# EAGLE design MoleNet_v21 (EAGLE 7.5.0)
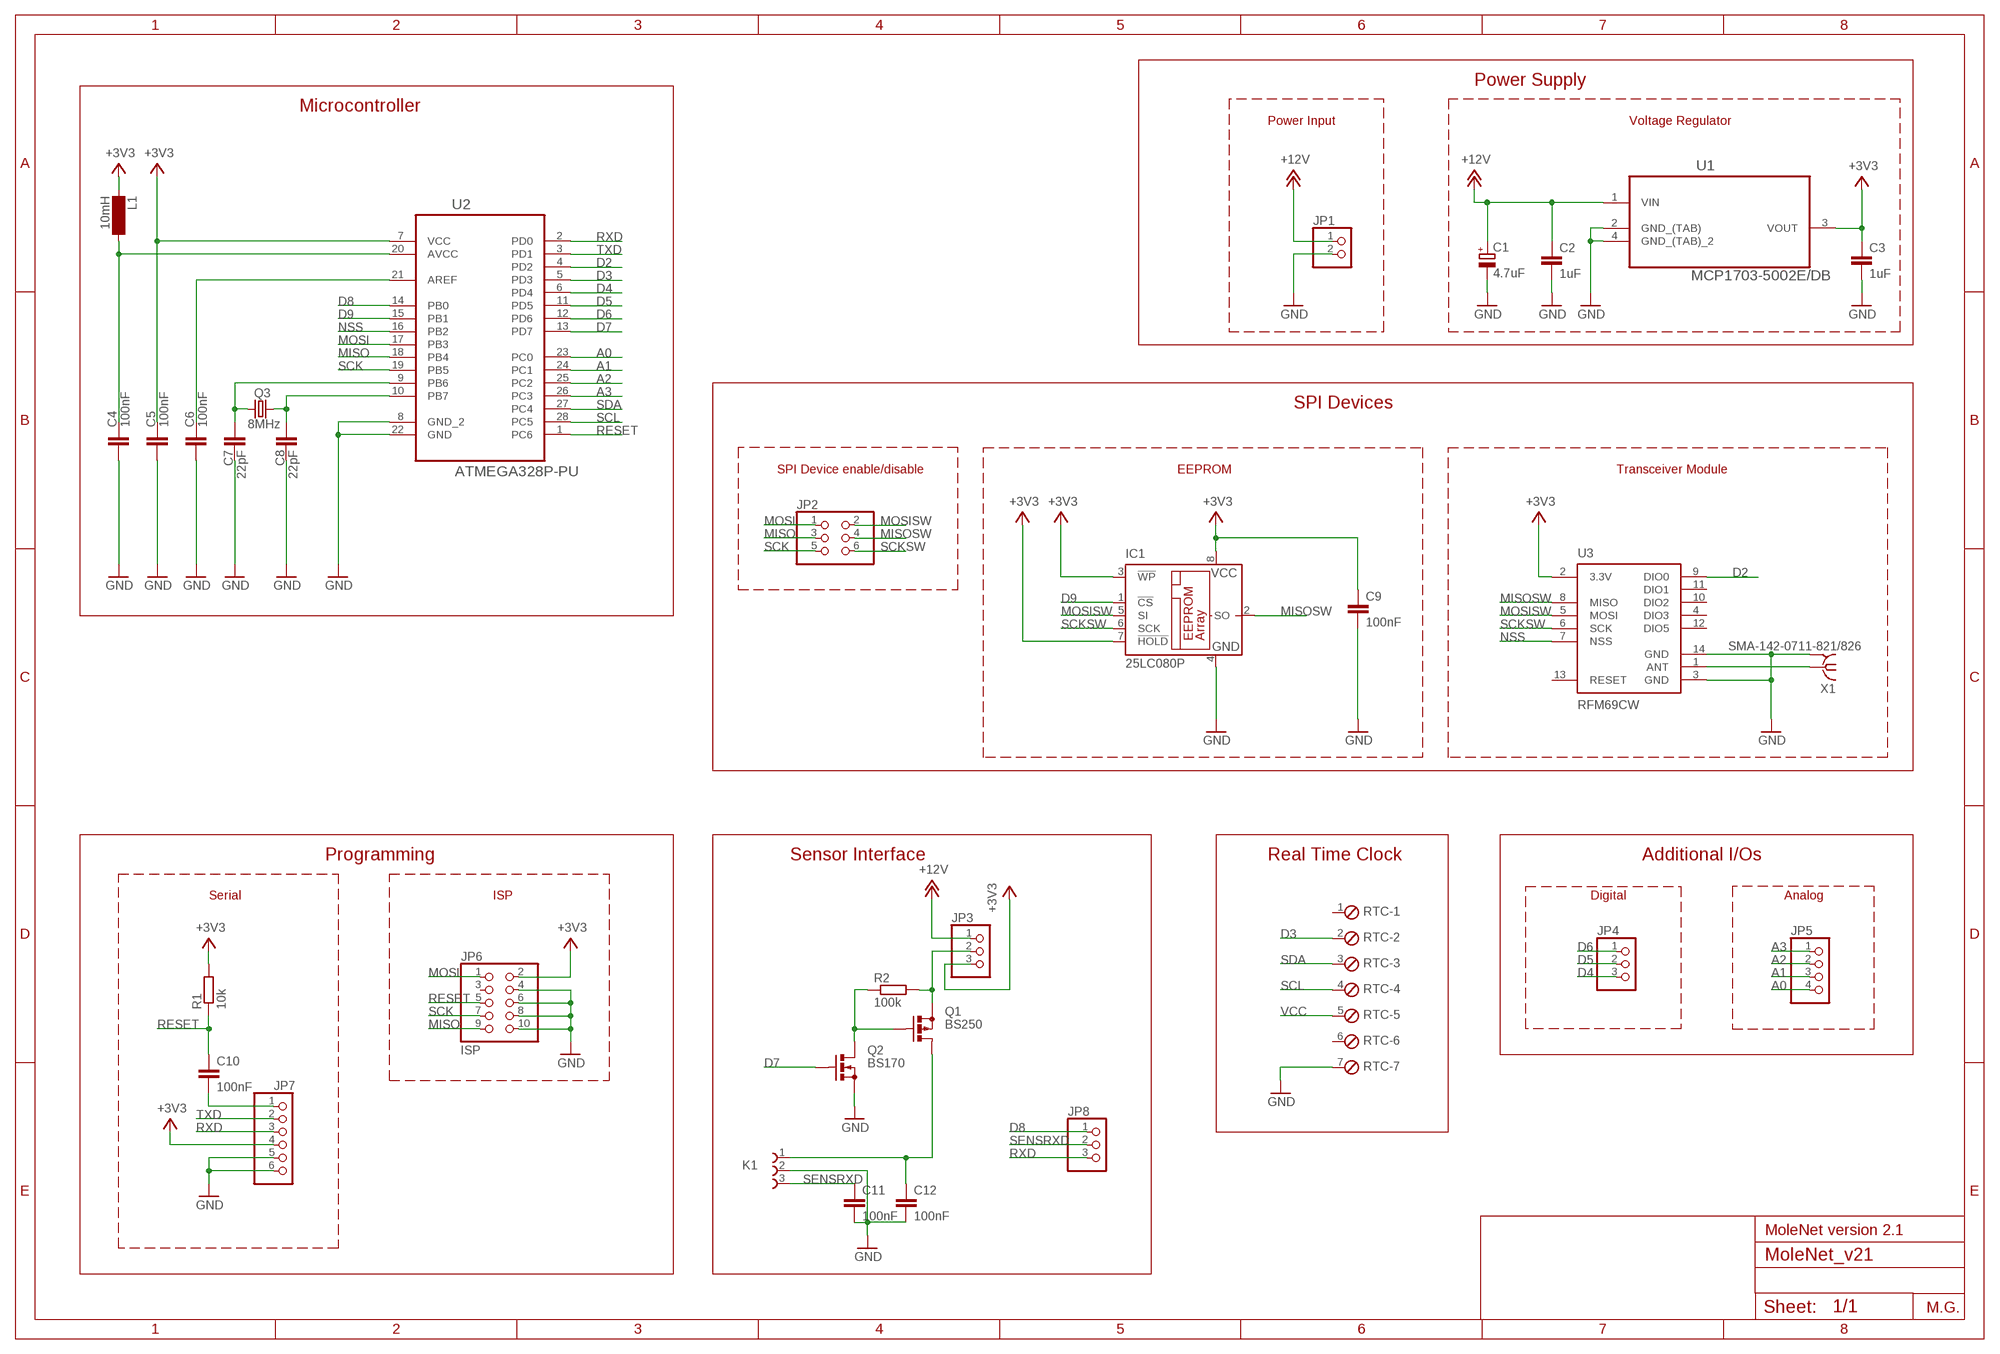
[diagram p0: schematic, sheet 1]

## Parts
C1  4.7uF  CPOL-EUE2.5-6  [E2,5-6]
C2  1uF  C-EU025-025X050  [C025-025X050]
C3  1uF  C-EU025-025X050  [C025-025X050]
C4  100nF  C-EU025-025X050  [C025-025X050]
C5  100nF  C-EU025-025X050  [C025-025X050]
C6  100nF  C-EU025-025X050  [C025-025X050]
C7  22pF  C-EU025-025X050  [C025-025X050]
C8  22pF  C-EU025-025X050  [C025-025X050]
C9  100nF  C-EU025-025X050  [C025-025X050]
C10  100nF  C-EU025-025X050  [C025-025X050]
C11  100nF  C-EU025-025X050  [C025-025X050]
C12  100nF  C-EU025-025X050  [C025-025X050]
IC1  25LC080P  [DIL8]
JP1  PINHD-1X2  [1X02]
JP2  PINHD-2X3  [2X03]
JP3  PINHD-1X3  [1X03]
JP4  PINHD-1X3  [1X03]
JP5  PINHD-1X4  [1X04]
JP6  ISP  PINHD-2X5  [2X05]
JP7  PINHD-1X6  [1X06]
JP8  PINHD-1X3  [1X03]
K1  691241710003  [691241710003]
L1  10mH  BS11  [BS11]
Q1  BS250  [SOT54E]
Q2  BS170  [SOT54E]
Q3  8MHz  CRYSTALHC18U-V  [HC18U-V]
R1  10k  R-EU_0207/10  [0207/10]
R2  100k  R-EU_0207/10  [0207/10]
RTC  MPT7  [7POL254]
U1  MCP1703-5002E/DB  [SOT230P700X180-4N]
U2  ATMEGA328P-PU  [DIP254P762X457-28]
U3  RFM69CW  [RFM69CW-XXXS2]
X1  SMA-142-0711-821/826  [J502-ND-142-0711-821/826]

## Nets
+12V: C1.+ C2.1 JP1.1 JP3.1 U1.1(VIN)
A0: JP5.4 U2.23(PC0)
A1: JP5.3 U2.24(PC1)
A2: JP5.2 U2.25(PC2)
A3: JP5.1 U2.26(PC3)
D2: U2.4(PD2) U3.9(DIO0)
D3: RTC.2 U2.5(PD3)
D4: JP4.3 U2.6(PD4)
D5: JP4.2 U2.11(PD5)
D6: JP4.1 U2.12(PD6)
D7: Q2.G U2.13(PD7)
D8: JP8.1 U2.14(PB0)
D9: IC1.1(!CS) U2.15(PB1)
GND: C1.- C2.2 C3.2 C4.2 C5.2 C6.2 C7.2 C8.2 C9.2 C11.2 C12.2 IC1.4(GND) JP1.2 JP6.4 JP6.6 JP6.8 JP6.10 JP7.5 JP7.6 K1.2 Q2.S RTC.7 U1.2(GND_(TAB)) U1.4(GND_(TAB)_2) U2.8(GND_2) U2.22(GND) U3.3(GND) U3.14(GND) X1.G@1 X1.G@2 X1.G@3 X1.G@4
MISO: JP2.3 JP6.9 U2.18(PB4)
MISOSW: IC1.2(SO) JP2.4 U3.8(MISO)
MOSI: JP2.1 JP6.1 U2.17(PB3)
MOSISW: IC1.5(SI) JP2.2 U3.5(MOSI)
N$1: Q1.G Q2.D R2.1
N$2: JP3.2 Q1.S R2.2
N$3: C7.1 Q3.1 U2.9(PB6)
N$4: C8.1 Q3.2 U2.10(PB7)
N$5: C4.1 L1.2 U2.20(AVCC)
N$6: C6.1 U2.21(AREF)
N$9: C10.2 JP7.1
N$10: C12.1 K1.1 Q1.D
N$15: U3.1(ANT) X1.1
NSS: U2.16(PB2) U3.7(NSS)
RESET: C10.1 JP6.5 R1.1 U2.1(PC6)
RXD: JP7.3 JP8.3 U2.2(PD0)
SCK: JP2.5 JP6.7 U2.19(PB5)
SCKSW: IC1.6(SCK) JP2.6 U3.6(SCK)
SCL: RTC.4 U2.28(PC5)
SDA: RTC.3 U2.27(PC4)
SENSRXD: C11.1 JP8.2 K1.3
TXD: JP7.2 U2.3(PD1)
VCC: C3.1 C5.1 C9.1 IC1.3(!WP) IC1.7(!HOLD) IC1.8(VCC) JP3.3 JP6.2 JP7.4 L1.1 R1.2 RTC.5 U1.3(VOUT) U2.7(VCC) U3.2(3.3V) ; supply symbol labelled +3V3
Unconnected: JP6.3 RTC.1 RTC.6 U3.4(DIO3) U3.10(DIO2) U3.11(DIO1) U3.12(DIO5) U3.13(RESET)

## Notes on the sheet
- Power Supply
- Microcontroller
- Power Input | Voltage Regulator
- SPI Devices
- SPI Device enable/disable | EEPROM | Transceiver Module
- Programming | Sensor Interface | Real Time Clock | Additional I/Os
- Serial | ISP | Digital | Analog
- MoleNet version 2.1
- M.G.

## Library data of the parts
C1 = resistor:CPOL-EU: POLARIZED CAPACITOR, European symbol
C2-C12 = resistor:C-EU: CAPACITOR, European symbol
IC1 = microchip:25*: Serial EEPROM 4K/ 8K , SPI bus; MF: MICROCHIP; MPN: 25LC080/P; OC_FARNELL: 1556143; OC_NEWARK: 92C7440
JP1 = pinhead:PINHD-1X2: PIN HEADER
JP2 = pinhead:PINHD-2X3: PIN HEADER
JP3 JP4 JP8 = pinhead:PINHD-1X3: PIN HEADER
JP5 = pinhead:PINHD-1X4: PIN HEADER
JP6 = pinhead:PINHD-2X5: PIN HEADER
JP7 = pinhead:PINHD-1X6: PIN HEADER
K1 = Terminal_Blocks_Connectors_rev15e:691241710003: SERIE 2417 - 5.00 MM - HORIZONTAL CABLE ENTRY WITH RISING CAGE CLAMP - WR-TBL =>ConTBL2 691241710003 Characteristics INSULATOR:PA6/66 FLAMABILITY RATING: UL94V0 COLOR: GREEN METAL HOUSING: COPPER ALLOY / Ni+Sn TERMINAL SCREW: STEEL / Zn WIRE GUARD: COPPER ALLOY / Ni+Sn FLANGES NUT: BRASS M2.5 OPERATING TEMPERATURE:-30°C UP TO +120°C COMPLIANCE: LEAD FREE AND ROHS ELECTRICAL UL VDE CURRENT RATING: 14A 14A WORKING VOLTAGE: 300VAC 250VAC WITHSTANDING VOLTAGE: 1,6KV 2KV CONTACT RESISTANCE: 20 mOhm max <http://katalog.we-online.de/media/images/v2/Family_WR-TBL_5_00_2417_HORIZONTAL_CABLE_ENTRY_6912417100XX.jpg> Details see: http://katalog.we-online.de/en/em/TBL_5_00_2417_HORIZONTAL_CABLE_ENTRY_W_RISING_CLAMP_6912417100XX 2015 (C) Wurth Elektronik
L1 = inductor-neosid:BS: INDUCTOR nominal inductance, magnetically screened; OC_FARNELL: unknown; OC_NEWARK: unknown
Q1 = transistor-small-signal:BS250: P-CHANNEL MOS FET
Q2 = transistor-small-signal:BS170: N-CHANNEL MOS FET
Q3 = crystal:CRYSTAL: CRYSTAL; OC_FARNELL: unknown; OC_NEWARK: unknown
R1 R2 = resistor:R-EU_: RESISTOR, European symbol
RTC = con-phoenix-254:MPT7: PHOENIX CONNECTOR; OC_FARNELL: unknown; OC_NEWARK: unknown
U1 = Microchip_By_element14_Batch_1:MCP1703-5002E/DB: IC, LDO REG, 250MA, 5V; MPN: MCP1703-5002E/DB; OC_FARNELL: 1627178; OC_NEWARK: 40M0624; PACKAGE: SOT-223-3; SUPPLIER: Microchip
U2 = Atmel_By_element14_Batch_1-00:ATMEGA328P-PU: 8-bit Microcontroller with In-System Programmable Flash; MPN: ATMEGA328P-PU; OC_FARNELL: 1715487; OC_NEWARK: 15R0268; PACKAGE: PDIP-28; SUPPLIER: Atmel
U3 = SparkFun-RF:RFM69
X1 = con-coax:SMA-: SMA 50 Ohm End Launch Jack Receptacle - Round Contact Johnson Components Source: www.johnsoncomponents.com .. J502-ND.pdf; MF: JOHNSON COMPONENTS; MPN: 142-0711-821; OC_FARNELL: 1019328; OC_NEWARK: 16F3627

## Board
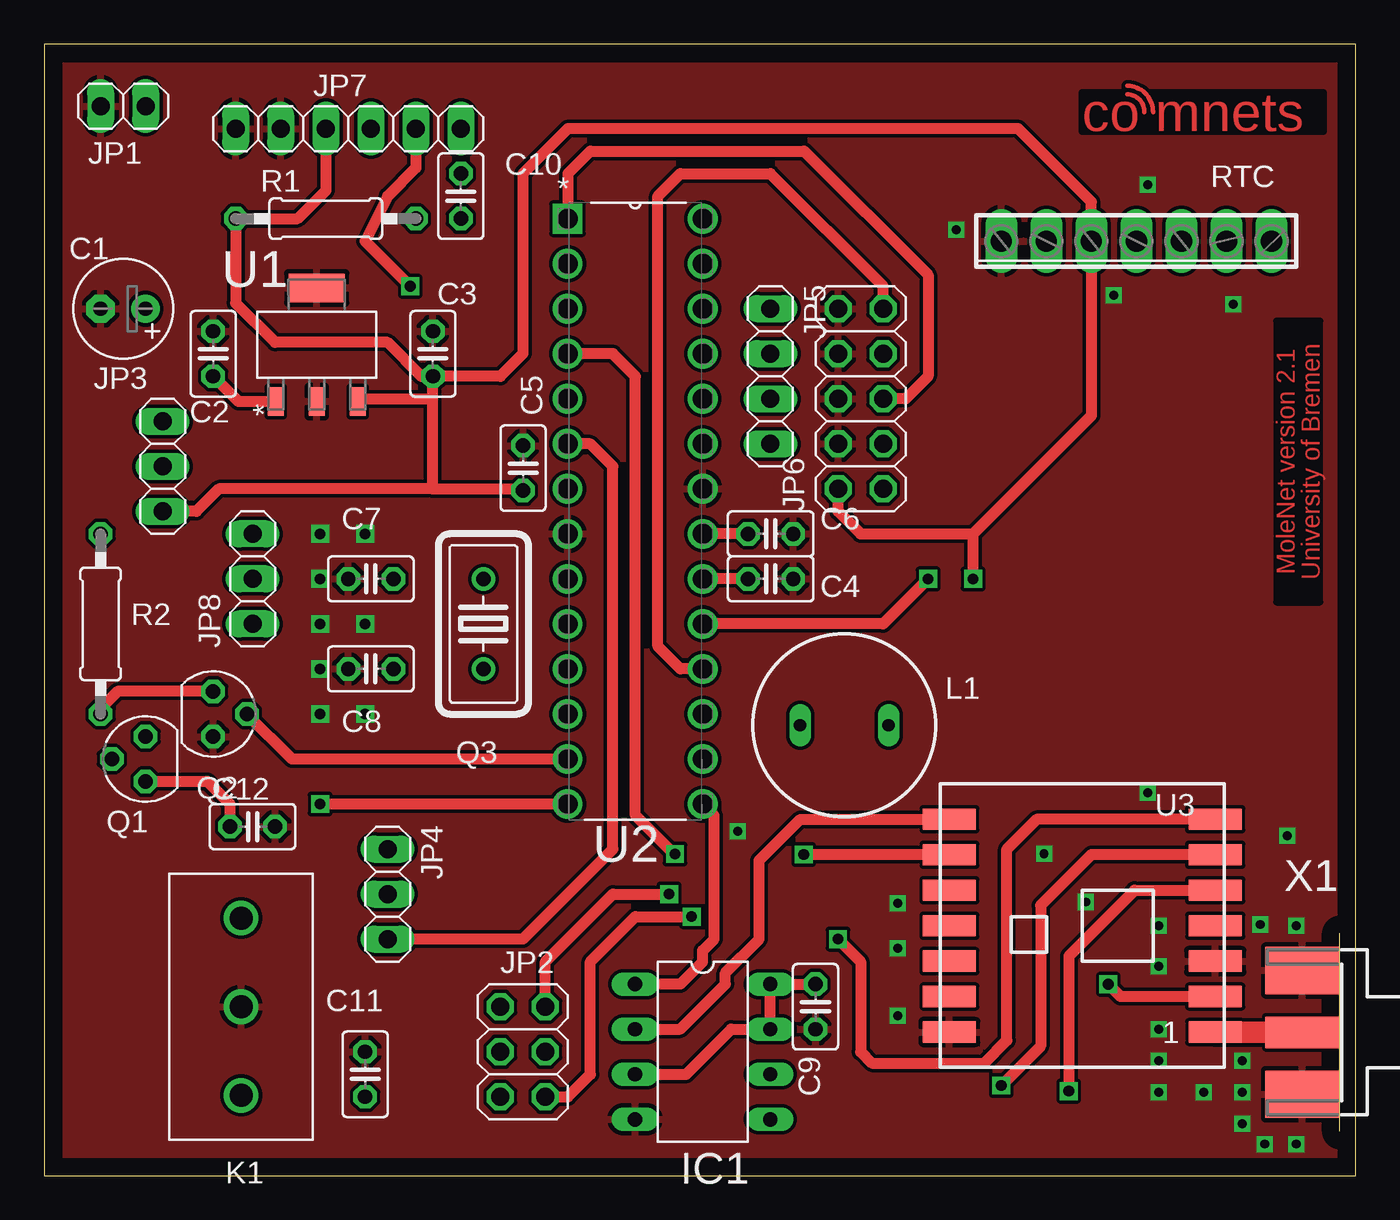
[diagram p1: board, top side]
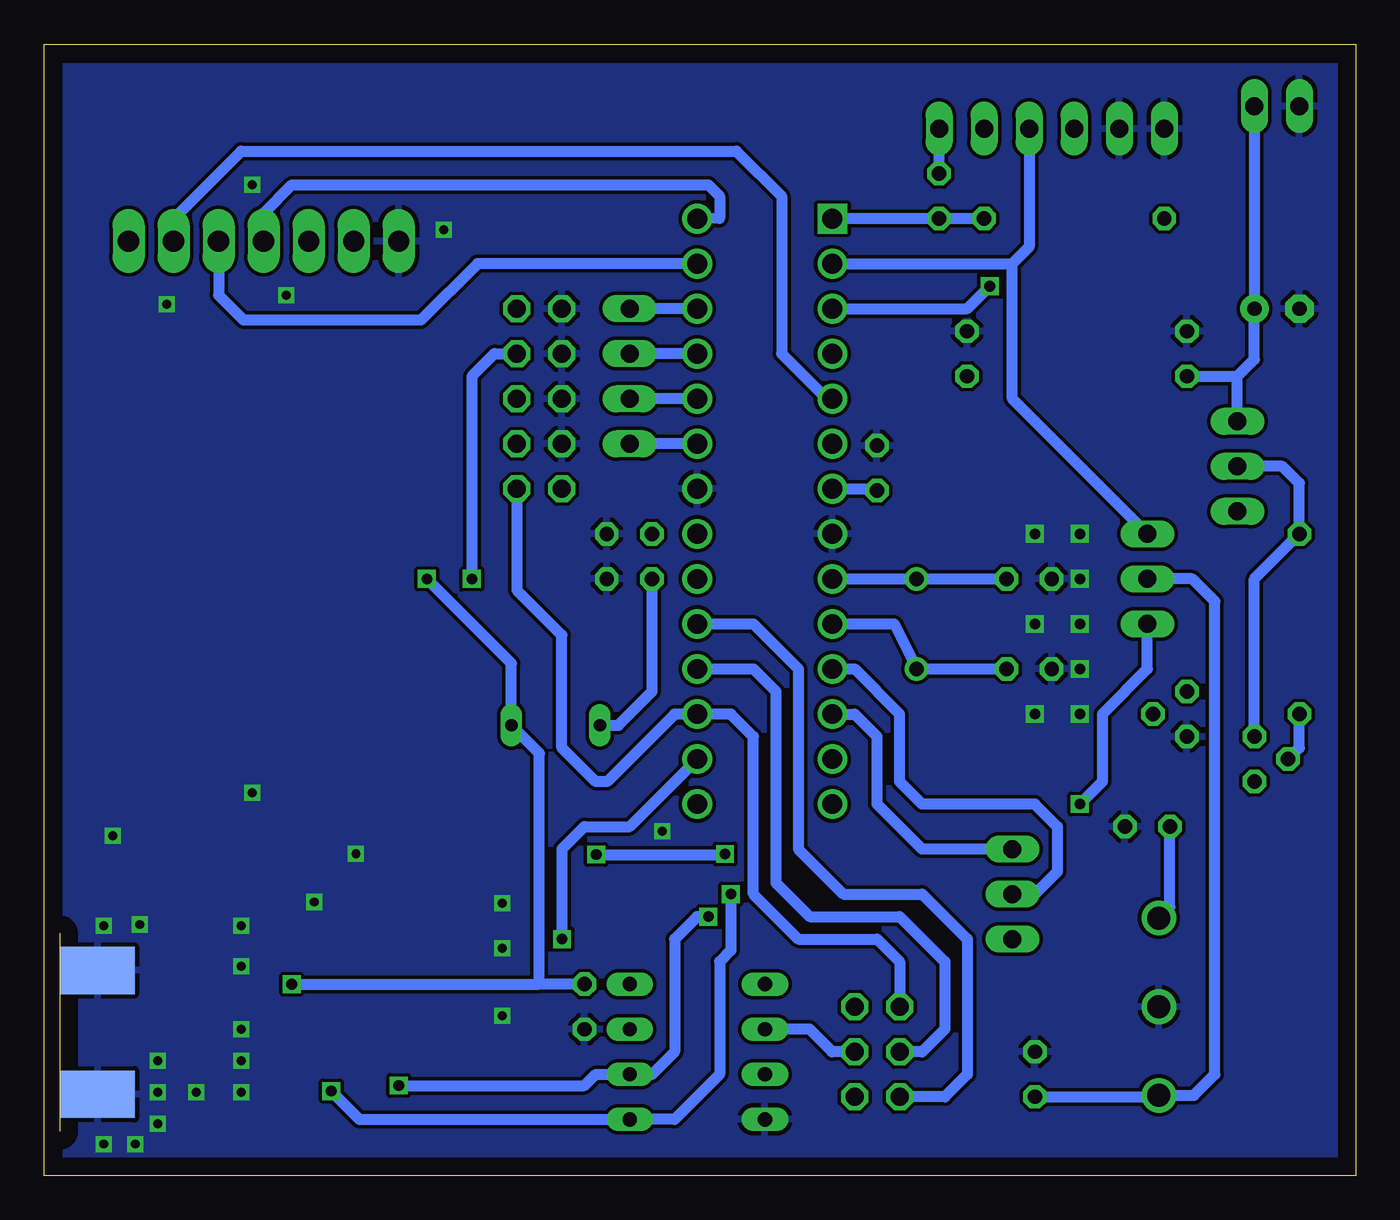
[diagram p2: board, bottom side, seen from below]

Size 73.97 x 63.81 mm. Coordinates in mm from the lower left corner, seen from the top.
Outline: 0,0 73.97,0 73.97,63.81 0,63.81 0,0
Copper layers (1*16): Top 0.035mm / dielectric 1.5mm / Bottom 0.035mm
Design rules "default": minimum track width 10mil, minimum drill 24mil, track to track 8mil, track to pad 8mil, pad to pad 8mil, via to via 8mil, smd to smd 8mil, copper to edge 40mil, drill to drill 8mil, minimum pad ring 10mil, minimum via ring 8mil, stop-mask expansion 4mil, vias tented up to drill 0mil, thermal gap 10mil

### Footprints (pad centres in the part's own frame; a part is rotated, then mirrored left to right if it is on the bottom)
E2,5-6 = drill 0.813 pad 1.6: + -1.27,0 | drill 0.813 pad 1.6 octagon: - 1.27,0
C025-025X050 = drill 0.813 octagon: 1 -1.27,0; 2 1.27,0
DIL8 = drill 0.813 long: 1 -3.81,-3.81; 2 -1.27,-3.81; 3 1.27,-3.81; 4 3.81,-3.81; 5 3.81,3.81; 6 1.27,3.81; 7 -1.27,3.81; 8 -3.81,3.81
1X02 = drill 1.016 long: 1 -1.27,0; 2 1.27,0
2X03 = drill 1.016 octagon: 1 -2.54,-1.27; 2 -2.54,1.27; 3 0,-1.27; 4 0,1.27; 5 2.54,-1.27; 6 2.54,1.27
1X03 = drill 1.016 long: 1 -2.54,0; 2 0,0; 3 2.54,0
1X04 = drill 1.016 long: 1 -3.81,0; 2 -1.27,0; 3 1.27,0; 4 3.81,0
2X05 = drill 1.016 octagon: 1 -5.08,-1.27; 2 -5.08,1.27; 3 -2.54,-1.27; 4 -2.54,1.27; 5 0,-1.27; 6 0,1.27; 7 2.54,-1.27; 8 2.54,1.27; 9 5.08,-1.27; 10 5.08,1.27
1X06 = drill 1.016 long: 1 -6.35,0; 2 -3.81,0; 3 -1.27,0; 4 1.27,0; 5 3.81,0; 6 6.35,0
691241710003 = drill 1.3: 1 -5,0; 2 0,0; 3 5,0
BS11 = drill 0.7 long: 1 -2.5,0; 2 2.5,0
SOT54E = drill 0.813 octagon: D -1.27,0; G 0,1.905; S 1.27,0
HC18U-V = drill 0.813: 1 -2.54,0; 2 2.54,0
0207/10 = drill 0.813 octagon: 1 -5.08,0; 2 5.08,0
7POL254 = drill 1.2 long: 1 -7.62,0; 2 -5.08,0; 3 -2.54,0; 4 0,0; 5 2.54,0; 6 5.08,0; 7 7.62,0
SOT230P700X180-4N = smd 1.626 x 0.889: 1 -3.2,2.311; 2 -3.2,0; 3 -3.2,-2.311 | smd 1.626 x 3.175: 4 3.2,0
DIP254P762X457-28 = drill 1.118 square: 1 -7.62,33.02 | drill 1.118: 2 -7.62,30.48; 3 -7.62,27.94; 4 -7.62,25.4; 5 -7.62,22.86; 6 -7.62,20.32; 7 -7.62,17.78; 8 -7.62,15.24; 9 -7.62,12.7; 10 -7.62,10.16; 11 -7.62,7.62; 12 -7.62,5.08; 13 -7.62,2.54; 14 -7.62,0; 15 0,0; 16 0,2.54; 17 0,5.08; 18 0,7.62; 19 0,10.16; 20 0,12.7; 21 0,15.24; 22 0,17.78; 23 0,20.32; 24 0,22.86; 25 0,25.4; 26 0,27.94; 27 0,30.48; 28 0,33.02
RFM69CW-XXXS2 = smd 3 x 1.2: 1 -7.5,6; 2 -7.5,4; 3 -7.5,2; 4 -7.5,0; 5 -7.5,-2; 6 -7.5,-4; 7 -7.5,-6; 8 7.5,-6; 9 7.5,-4; 10 7.5,-2; 11 7.5,0; 12 7.5,2; 13 7.5,4; 14 7.5,6
J502-ND-142-0711-821/826 = smd 4.191 x 1.778: 1 2.115,0 | smd 4.191 x 2.667: G@1 2.115,3.495; G@2 2.115,-3.495 | smd 4.191 x 2.667 bottom: G@3 2.115,3.495; G@4 2.115,-3.495

### Placement (x,y rotation side)
C1  10uF  [E2,5-6]  4.45,48.89 180 top
C2  [C025-025X050]  9.52,46.35 90 top
C3  [C025-025X050]  21.92,46.35 90 top
C4  [C025-025X050]  40.97,33.66 0 top
C5  [C025-025X050]  27,39.9 90 top
C6  [C025-025X050]  40.97,36.2 0 top
C7  [C025-025X050]  18.41,33.66 180 top
C8  [C025-025X050]  18.41,28.58 180 top
C9  [C025-025X050]  43.5,9.53 270 top
C10  [C025-025X050]  23.5,55.24 90 top
C11  [C025-025X050]  18.1,5.71 90 top
C12  [C025-025X050]  11.75,19.69 0 top
IC1  37.13,6.98 270 top
JP1  4.45,60.32 180 top
JP2  26.99,6.98 270 top
JP3  6.67,40 270 top
JP4  19.37,15.88 270 top
JP5  40.96,45.09 270 top
JP6  46.04,43.81 90 top
JP7  17.14,59.05 180 top
JP8  11.75,33.66 90 top
K1  11.1,9.53 270 top
L1  [BS11]  45.12,25.4 180 top
Q1  5.72,23.5 90 top
Q2  9.52,26.04 270 top
Q3  [HC18U-V]  24.77,31.12 270 top
R1  [0207/10]  15.88,53.98 180 top
R2  [0207/10]  3.18,31.12 90 top
RTC  61.59,52.7 180 top
U1  15.37,46.86 90 top
U2  37.13,20.96 0 top
U3  58.55,14.1 180 top
X1  73.08,8.08 180 top

### Tracks (layer width: path | path; a pad name or v marks a point on that pad's centre or on a via)
+12V
  Top 0.61: C2.1 10.95,43.66 U1.1
  Bottom 0.61: JP1.1 C1.+ 5.72,46.04 6.67,45.09 | C2.1 6.67,45.09 | JP3.1 6.67,45.09
A0
  Bottom 0.61: U2.23 JP5.4
A1
  Bottom 0.61: U2.24 JP5.3
A2
  Bottom 0.61: U2.25 JP5.2
A3
  Bottom 0.61: U2.26 JP5.1
D2  (via drill 0.6)
  Top 0.61: U2.4 32.07,46.35 33.34,45.09 33.34,20.32 35.52,18.14 v35.57,18.14 | U3.9 44.37,18.1 v42.84,18.11
  Bottom 0.61: v42.84,18.11 35.6,18.11 v35.57,18.14
D3
  Bottom 0.61: RTC.2 66.67,53.98 62.87,57.78 34.92,57.78 32.38,55.24 32.38,46.35 29.84,43.81 U2.5
D4
  Top 0.61: U2.6 30.8,41.27 32.07,40 32.07,18.42 26.99,13.33 JP4.3
D5
  Bottom 0.61: U2.11 28.26,28.58 25.72,26.04 25.72,22.23 24.45,20.96 18.1,20.96 16.83,19.69 16.83,17.15 18.1,15.88 JP4.2
D6
  Bottom 0.61: U2.12 28.26,26.04 26.99,24.77 26.99,20.96 24.45,18.42 JP4.1
D7
  Top 0.61: U2.13 13.97,23.5 Q2.G
D8  (via drill 0.6)
  Top 0.61: U2.14 v15.56,20.96
  Bottom 0.61: JP8.1 11.75,28.58 14.29,26.04 14.29,22.23 v15.56,20.96
D9
  Top 0.61: IC1.1 35.88,10.79 37.13,12.05 37.13,12.69 37.78,13.33 37.78,20.31 U2.15
GND  (via drill 0.5, 0.6)
  other vias: 70.1,19.18 70.61,14.1 70.61,1.78 68.58,14.16 67.56,4.7 67.56,2.92 67.56,6.48 62.87,14.1 62.87,11.81 62.87,8.26 62.87,4.7 48.13,15.37 48.13,12.83 48.13,9.02 58.74,15.43 67.06,49.15 60.33,49.66 62.87,6.48 68.83,1.78 65.41,4.7 56.39,18.16 62.23,21.59 62.23,55.88 39.12,19.43 51.44,53.34 18.1,36.2 15.56,33.66 15.56,31.12 15.56,28.58 18.1,31.12 18.1,26.04 15.56,26.04 15.56,36.2
  pour Top: 0.63,62.86 72.9,62.86 72.9,0.89 0.63,0.89
  pour Bottom: 0.63,62.86 72.9,62.86 72.9,0.89 0.63,0.89
MISO
  Top 0.61: U2.18 35.88,28.58 34.61,29.85 34.61,55.24 35.88,56.52 40.96,56.52 47.31,50.16 JP6.9
  Bottom 0.61: U2.18 33.97,28.58 32.7,27.31 32.7,16.51 30.8,14.61 25.72,14.61 23.18,12.06 23.18,8.26 24.45,6.98 JP2.3
MISOSW
  Top 0.61: U3.8 42.64,20.1 40.32,17.78 40.32,13.33 38.42,11.43 38.42,10.79 35.88,8.26 IC1.2
  Bottom 0.61: JP2.4 29.53,6.98 30.8,8.26 IC1.2
MOSI
  Bottom 0.61: JP2.1 25.72,12.06 26.99,13.33 31.43,13.33 33.97,15.88 33.97,24.77 35.24,26.04 U2.17 38.42,26.04 42.23,22.23 42.86,22.23 44.77,24.13 44.77,30.48 47.31,33.02 JP6.1
MOSISW  (via drill 0.6)
  Top 0.61: U3.5 61.5,16.1 57.78,12.38 v57.78,4.76 | JP2.2 28.26,12.06 32.07,15.88 v35.24,15.88
  Bottom 0.61: v57.78,4.76 56.2,3.17 IC1.5 38.42,3.17 35.88,5.71 35.88,12.06 35.24,12.7 v35.24,15.88
N$1
  Top 0.61: Q2.D 4.13,27.31 3.18,26.35 R2.1
  Bottom 0.61: Q1.G 3.18,24.13 R2.1
N$2
  Bottom 0.61: JP3.2 4.13,40 3.18,39.05 R2.2 5.72,33.66 Q1.S
N$3
  Bottom 0.61: U2.9 Q3.1 C7.1
N$4
  Bottom 0.61: C8.1 Q3.2 26.04,31.12 U2.10
N$5
  Top 0.61: C4.1 U2.20
  Bottom 0.61: L1.2 41.59,25.4 39.69,27.31 39.69,33.64 C4.1
N$6
  Top 0.61: C6.1 U2.21
N$7
  Top 0.254: 61.09,60.98 arc-90 62.05,59.97
N$8
  Top 0.254: 61.09,61.47 arc-90 62.53,59.97
N$9
  Bottom 0.61: C10.2 JP7.1
N$10
  Top 0.61: C12.1 10.48,20.96 9.21,22.23 Q1.D
  Bottom 0.61: K1.1 10.48,15.15 C12.1
N$15
  Top 0.61: U3.1 66.07,8.08
  Top 1.219: 66.07,8.08 X1.1
NSS  (via drill 0.6)
  Top 0.61: v44.77,13.33 46.04,12.06 46.04,6.98 46.67,6.35 53.02,6.35 54.29,7.62 54.29,18.42 55.97,20.1 U3.7
  Bottom 0.61: v44.77,13.33 44.77,18.42 43.5,19.69 40.96,19.69 U2.16
RESET
  Top 0.61: JP6.5 48.58,43.81 49.85,45.09 49.85,50.8 42.86,57.78 30.8,57.78 29.53,56.52 29.53,53.99 U2.1
  Bottom 0.61: R1.1 C10.1 U2.1
RXD
  Bottom 0.61: 19.37,51.43 18.41,52.39 JP7.3 | U2.2 19.37,51.43 | 19.37,51.43 19.37,43.81 JP8.3
SCK  (via drill 0.6)
  Top 0.61: v49.85,33.66 47.31,31.12 U2.19
  Bottom 0.61: JP6.7 48.58,46.35 49.85,45.09 v49.85,33.66 | U2.19 33.97,31.12 31.43,28.58 31.43,18.42 28.89,15.88 24.45,15.88 21.91,13.33 21.91,5.71 23.18,4.45 JP2.5
SCKSW  (via drill 0.6)
  Top 0.61: v53.98,5.08 56.2,7.3 56.2,15.24 59.05,18.1 U3.6 | JP2.6 29.53,4.45 30.8,5.71 30.8,12.06 33.34,14.61 v36.51,14.61
  Bottom 0.61: v36.51,14.61 37.15,14.61 38.42,13.33 38.42,6.98 39.69,5.71 IC1.6 42.86,5.71 43.5,5.08 v53.98,5.08
SCL
  Bottom 0.61: RTC.4 61.59,54.29 60.01,55.88 36.51,55.88 35.88,55.24 35.88,53.99 U2.28
SDA
  Bottom 0.61: RTC.3 64.14,49.66 62.74,48.26 52.7,48.26 49.53,51.43 U2.27
SENSRXD
  Bottom 0.61: C11.1 11.18,4.45 K1.3 9.13,4.53 7.94,5.71 7.94,32.38 9.21,33.66 JP8.2
TXD  (via drill 0.6)
  Top 0.61: JP7.2 20.95,56.83 19.37,55.24 18.1,52.7 v20.64,50.16
  Bottom 0.61: U2.3 21.91,48.89 v20.64,50.16
VCC  (via drill 0.6)
  Top 0.61: U3.2 60.71,10.1 v60.01,10.79 | IC1.3 36.2,5.71 38.74,8.26 IC1.7 IC1.8 C9.1 | 21.91,38.73 21.91,43.81 | 21.91,43.81 21.91,45.07 C3.1 | JP7.4 15.88,55.56 14.29,53.98 R1.2 10.8,49.21 13.02,46.99 19.37,46.99 21.27,45.09 C3.1 | 52.39,36.2 46.04,36.2 44.77,37.46 JP6.2 | v52.39,33.66 52.39,36.2 | U1.3 17.83,43.81 21.91,43.81 | 21.91,38.73 9.84,38.73 8.57,37.46 JP3.3 | C3.1 25.72,45.09 26.99,46.35 26.99,56.52 29.53,59.05 54.93,59.05 59.06,54.93 RTC.5 59.06,42.86 52.39,36.2 | 21.91,38.73 26.9,38.73 C5.1
  Bottom 0.61: U2.7 27.1,38.73 C5.1 | v52.39,33.66 47.62,28.89 L1.1 46.04,23.81 46.04,10.79 | C9.1 46.04,10.79 | v60.01,10.79 46.04,10.79

### Text on the board
Top: co mnets | MoleNet version 2.1 / University of Bremen